# EAGLE design KYBRDv2 (EAGLE 9.3.0)
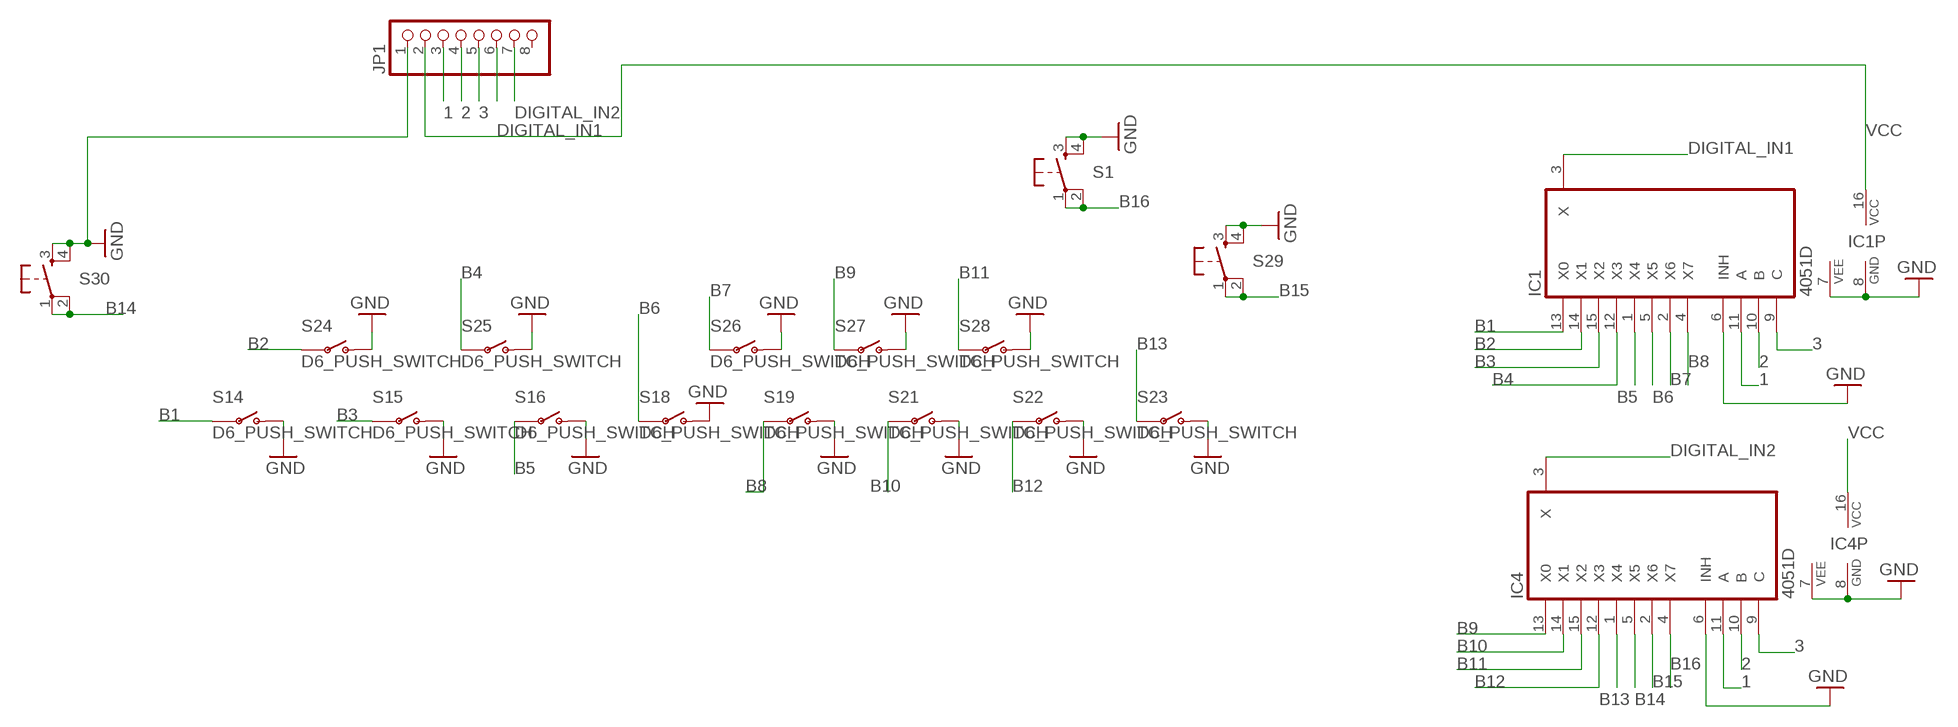
[diagram p0: schematic, sheet 1]

## Parts
IC1  4051D  [SO16]
IC4  4051D  [SO16]
JP1  PINHD-1X8  [1X08]
S1  DTSM-6  [DTSM-6]
S14  D6_PUSH_SWITCH  [D6_PUSH_SWITCH]
S15  D6_PUSH_SWITCH  [D6_PUSH_SWITCH]
S16  D6_PUSH_SWITCH  [D6_PUSH_SWITCH]
S18  D6_PUSH_SWITCH  [D6_PUSH_SWITCH]
S19  D6_PUSH_SWITCH  [D6_PUSH_SWITCH]
S21  D6_PUSH_SWITCH  [D6_PUSH_SWITCH]
S22  D6_PUSH_SWITCH  [D6_PUSH_SWITCH]
S23  D6_PUSH_SWITCH  [D6_PUSH_SWITCH]
S24  D6_PUSH_SWITCH  [D6_PUSH_SWITCH]
S25  D6_PUSH_SWITCH  [D6_PUSH_SWITCH]
S26  D6_PUSH_SWITCH  [D6_PUSH_SWITCH]
S27  D6_PUSH_SWITCH  [D6_PUSH_SWITCH]
S28  D6_PUSH_SWITCH  [D6_PUSH_SWITCH]
S29  DTSM-6  [DTSM-6]
S30  DTSM-6  [DTSM-6]

## Nets
1: IC1.11(A) IC4.11(A) JP1.3
2: IC1.10(B) IC4.10(B) JP1.4
3: IC1.9(C) IC4.9(C) JP1.5
B1: IC1.13(X0) S14.P$3(P) S14.P$4(P)
B2: IC1.14(X1) S24.P$3(P) S24.P$4(P)
B3: IC1.15(X2) S15.P$3(P) S15.P$4(P)
B4: IC1.12(X3) S25.P$3(P) S25.P$4(P)
B5: IC1.1(X4) S16.P$3(P) S16.P$4(P)
B6: IC1.5(X5) S18.P$3(P) S18.P$4(P)
B7: IC1.2(X6) S26.P$3(P) S26.P$4(P)
B8: IC1.4(X7) S19.P$3(P) S19.P$4(P)
B9: IC4.13(X0) S27.P$3(P) S27.P$4(P)
B10: IC4.14(X1) S21.P$3(P) S21.P$4(P)
B11: IC4.15(X2) S28.P$3(P) S28.P$4(P)
B12: IC4.12(X3) S22.P$3(P) S22.P$4(P)
B13: IC4.1(X4) S23.P$3(P) S23.P$4(P)
B14: IC4.5(X5) S30.1 S30.2
B15: IC4.2(X6) S29.1 S29.2
B16: IC4.4(X7) S1.1 S1.2
DIGITAL_IN1: IC1.3(X) JP1.6
DIGITAL_IN2: IC4.3(X) JP1.7
GND: IC1.6(INH) IC1.7(VEE) IC1.8(GND) IC4.6(INH) IC4.7(VEE) IC4.8(GND) JP1.1 S1.3 S1.4 S14.P$1(O) S14.P$2(O) S15.P$1(O) S15.P$2(O) S16.P$1(O) S16.P$2(O) S18.P$1(O) S18.P$2(O) S19.P$1(O) S19.P$2(O) S21.P$1(O) S21.P$2(O) S22.P$1(O) S22.P$2(O) S23.P$1(O) S23.P$2(O) S24.P$1(O) S24.P$2(O) S25.P$1(O) S25.P$2(O) S26.P$1(O) S26.P$2(O) S27.P$1(O) S27.P$2(O) S28.P$1(O) S28.P$2(O) S29.3 S29.4 S30.3 S30.4
VCC: IC1.16(VCC) IC4.16(VCC) JP1.2
Unconnected: JP1.8

## Library data of the parts
IC1 IC4 = 40xx:4051: 8-channel ANALOG MULTIPLEXER
JP1 = pinhead:PINHD-1X8: PIN HEADER
S1 S29 S30 = switch-tact:DTSM-6
S14-S16 S18 S19 S21-S28 = MusicThingModular:D6_PUSH_SWITCH: Push switch

## Board
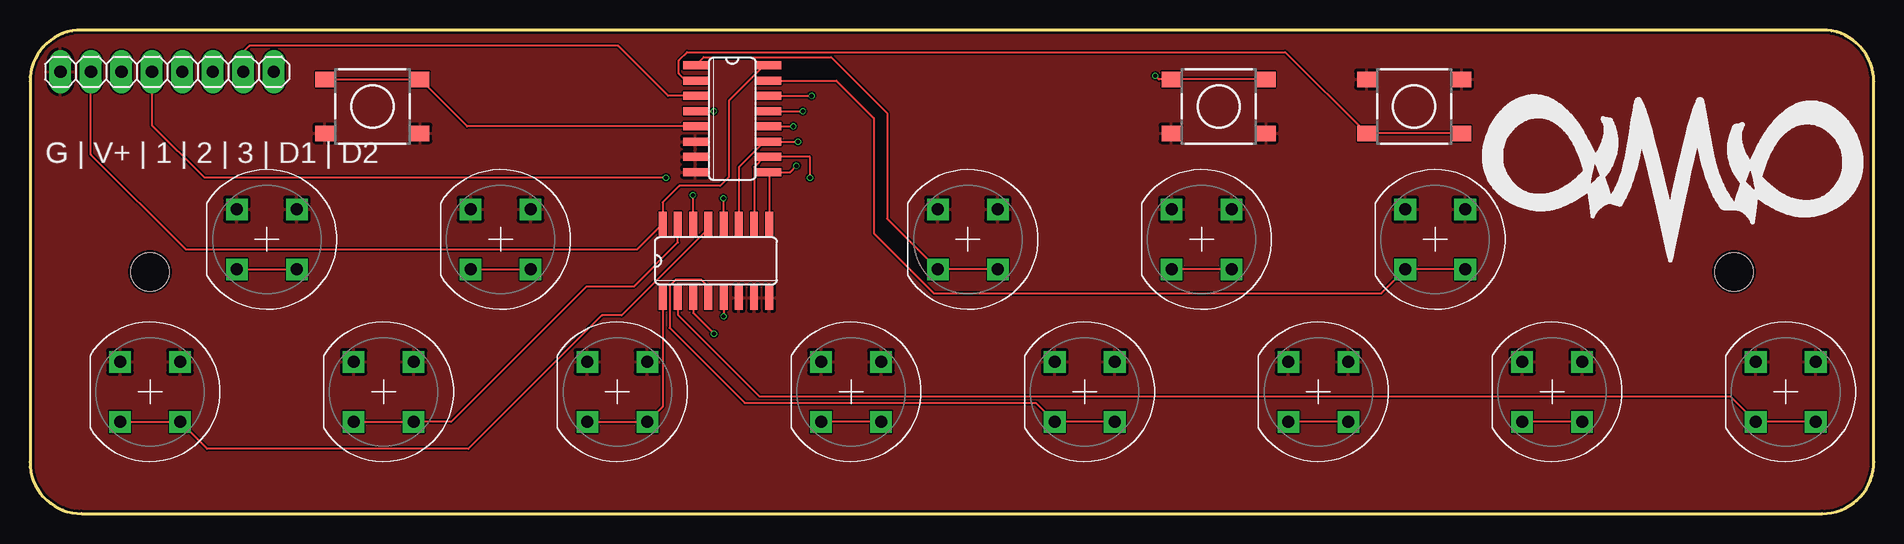
[diagram p1: board, top side]
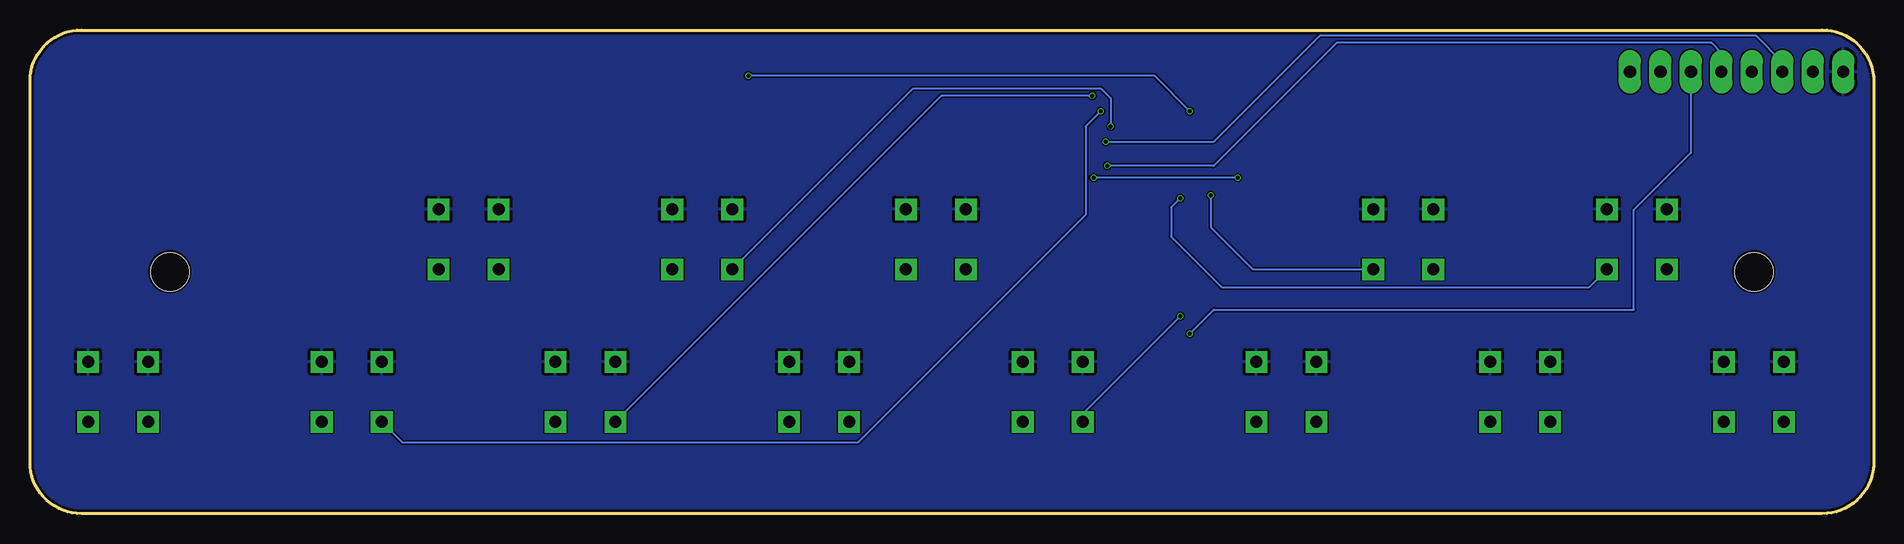
[diagram p2: board, bottom side, seen from below]

Size 153.65 x 40.31 mm. Coordinates in mm from the lower left corner, seen from the top.
Outline: 4.3,0 149.35,0 arc90 153.65,4.3 153.65,36.01 arc90 149.35,40.31 4.3,40.31 arc90 0,36.01 0,4.3 arc90 4.3,0
Copper layers (1*16): Top 0.035mm / dielectric 1.6mm / Bottom 0.035mm
Design rules "jlcpcb-2layers": minimum track width 5mil, minimum drill 0.3mm, track to track 5mil, track to pad 5mil, pad to pad 5mil, via to via 5mil, smd to smd 5mil, copper to edge 0.2mm, drill to drill 6mil, minimum pad ring 10mil, minimum via ring 3mil, stop-mask expansion 4mil, vias tented up to drill 0mil, thermal gap 10mil
Holes 3.2 mm at 142,20.16 10,20.16

### Footprints (pad centres in the part's own frame; a part is rotated, then mirrored left to right if it is on the bottom)
SO16 = smd 0.66 x 2.032: 1 -4.445,-3.073; 2 -3.175,-3.073; 3 -1.905,-3.073; 4 -0.635,-3.073; 5 0.635,-3.073; 6 1.905,-3.073; 7 3.175,-3.073; 8 4.445,-3.073; 9 4.445,3.073; 10 3.175,3.073; 11 1.905,3.073; 12 0.635,3.073; 13 -0.635,3.073; 14 -1.905,3.073; 15 -3.175,3.073; 16 -4.445,3.073
1X08 = drill 1.016 long: 1 -8.89,0; 2 -6.35,0; 3 -3.81,0; 4 -1.27,0; 5 1.27,0; 6 3.81,0; 7 6.35,0; 8 8.89,0
DTSM-6 = smd 1.55 x 1.3: 1 -3.975,2.25; 2 3.975,2.25; 3 -3.975,-2.25; 4 3.975,-2.25
D6_PUSH_SWITCH = drill 1 square: P$1 -2.5,2.5; P$2 2.5,2.5; P$3 2.5,-2.5; P$4 -2.5,-2.5

### Placement (x,y rotation side)
IC1  57.16,21.07 0 top
IC4  58.52,32.91 270 top
JP1  11.43,36.83 0 top
S1  99.06,33.94 0 top
S14  10,10.16 0 top
S15  29.47,10.16 0 top
S16  48.95,10.16 0 top
S18  68.42,10.16 0 top
S19  87.89,10.16 0 top
S21  107.37,10.16 0 top
S22  97.63,22.86 0 top
S23  78.16,22.86 0 top
S24  39.21,22.86 0 top
S25  19.74,22.86 0 top
S26  146.31,10.16 0 top
S27  126.84,10.16 0 top
S28  117.1,22.86 0 top
S29  115.35,33.94 180 top
S30  28.54,33.94 0 top

### Tracks (layer width: path | path; a pad name or v marks a point on that pad's centre or on a via)
1  (via drill 0.35)
  Top 0.152: IC1.11 59.06,28.88 61.19,31 IC4.11 v64,31
  Bottom 0.152: v64,31 55,31 46.15,39.85 9.85,39.85 7.62,37.62 JP1.3
2  (via drill 0.35)
  Top 0.152: IC1.10 60.34,28.88 61.19,29.73 IC4.10 61.6,29.75 65,29.75 v65,28 | v53,28 14.54,28 10.16,32.38 JP1.4
  Bottom 0.152: v53,28 v65,28
3  (via drill 0.35)
  Top 0.152: IC1.9 61.6,28.45 IC4.9 63.35,28.46 v63.87,28.98
  Bottom 0.152: JP1.5 12.7,38.43 13.51,39.24 44.76,39.24 55.02,28.98 v63.87,28.98
B1
  Top 0.152: S14.P$4 S14.P$3 14.75,5.41 36.54,5.41 47.66,16.53 49.31,16.53 56.52,23.74 IC1.13
B2  (via drill 0.35)
  Top 0.152: S24.P$4 S24.P$3 | IC1.14 55.26,26.53 v55.24,26.54
  Bottom 0.152: S24.P$3 51.75,20.36 55.24,23.86 v55.24,26.54
B3
  Top 0.152: S15.P$4 S15.P$3 35.09,7.66 46.35,18.92 50.29,18.92 53.98,22.62 IC1.15
B4  (via drill 0.35)
  Top 0.152: S25.P$4 S25.P$3 | IC1.12 57.8,26.28 v57.78,26.29
  Bottom 0.152: S25.P$3 23.73,18.87 54.32,18.87 58.55,23.09 58.55,25.53 v57.78,26.29
B5
  Top 0.152: IC1.1 52.72,8.93 S16.P$3 S16.P$4
B6  (via drill 0.35)
  Top 0.152: IC1.5 v57.8,16.45 | S18.P$3 S18.P$4
  Bottom 0.152: v57.8,16.45 65.92,8.32 S18.P$4
B7
  Top 0.152: S26.P$3 S26.P$4 141.69,9.78 60.78,9.78 53.98,16.58 IC1.2
B8
  Top 0.152: S19.P$3 S19.P$4 83.82,9.23 59.56,9.23 53.3,15.49 53.3,18.98 53.81,19.5 55.93,19.5 56.52,18.9 IC1.4
B9  (via drill 0.35)
  Top 0.152: S27.P$3 S27.P$4 | IC4.13 v64.41,33.55
  Bottom 0.152: v64.41,33.55 65.68,32.27 65.68,24.91 84.67,5.92 122.59,5.92 S27.P$4
B10  (via drill 0.35)
  Top 0.152: S21.P$3 S21.P$4 | IC4.14 v65.13,34.81
  Bottom 0.152: v65.13,34.81 77.71,34.81 S21.P$4
B11
  Top 0.152: S28.P$3 S28.P$4 112.6,18.36 75.32,18.36 70.31,23.36 70.31,32.97 67.2,36.09 IC4.15
B12  (via drill 0.35)
  Top 0.152: S22.P$3 S22.P$4 | IC4.12 v63.6,32.27
  Bottom 0.152: v63.6,32.27 63.6,34.63 64.39,35.42 80.07,35.42 S22.P$4
B13
  Top 0.152: S23.P$3 S23.P$4 71.43,24.59 71.43,33.38 66.77,38.04 56.13,38.04 IC4.1
B14
  Top 0.152: IC4.5 36.43,32.27 S30.2 S30.1
B15
  Top 0.152: S29.1 S29.2 104.59,38.47 54.77,38.47 54.08,37.78 54.08,36.68 54.67,36.09 IC4.2
B16  (via drill 0.35)
  Top 0.152: IC4.4 v56.99,33.55 | v93.78,36.49 94.08,36.19 S1.1 S1.2
  Bottom 0.152: v56.99,33.55 59.94,36.49 v93.78,36.49
DIGITAL_IN1  (via drill 0.35)
  Top 0.152: IC1.3 55.26,16.75 v57,15
  Bottom 0.152: v57,15 55,17 20,17 20,25.32 15.24,30.08 JP1.6
DIGITAL_IN2
  Top 0.152: IC4.3 53.19,34.81 49.01,38.99 18.29,38.99 17.78,38.48 JP1.7
GND
  pour Top: 0,41.11 153.32,41.11 153.32,-0.03 2.81,-0.03 0,2.78
  pour Bottom: 0,41 154,41 154,1 153,0 1,0 0,1
VCC
  Top 0.152: IC4.16 61.19,37.35 58.23,34.4 58.23,28.06 57.51,27.33 54.1,27.33 52.72,25.94 IC1.16 50.57,22 13,22 5.08,29.92 JP1.2

### Text on the board
tNames: G | V+ | 1 | 2 | 3 | D1 | D2